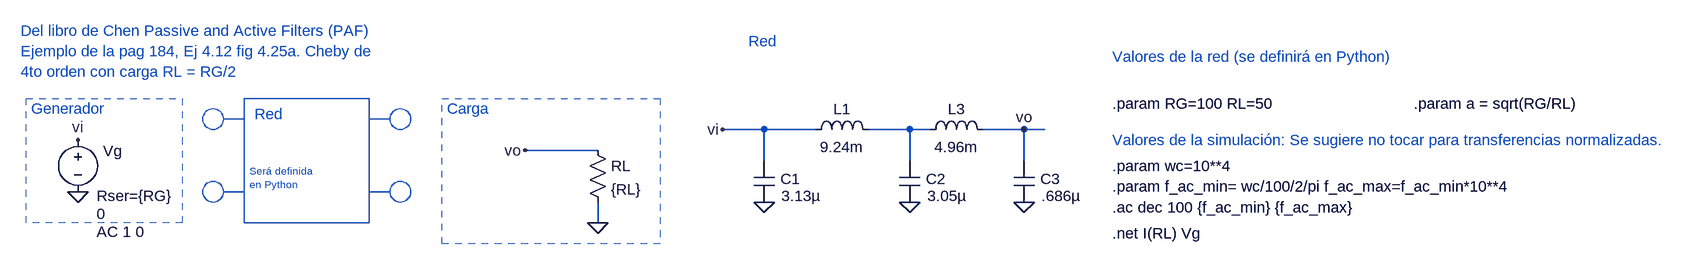
[diagram p0: schematic spar chen PAF butter 5 Ej 4.12 fig 4.25a.asc]
spar chen PAF butter 5 Ej 4.12 fig 4.25a.asc, the LTspice schematic file:
Version 4
SHEET 1 1884 872
WIRE -112 144 -176 144
WIRE -32 144 -112 144
WIRE 112 144 48 144
WIRE 144 144 112 144
WIRE 288 144 224 144
WIRE 320 144 288 144
WIRE -368 176 -480 176
WIRE -112 192 -112 144
WIRE 112 192 112 144
WIRE 288 192 288 144
WIRE -368 288 -368 256
FLAG -1168 240 0
FLAG -112 256 0
FLAG -368 288 0
FLAG -1168 160 vi
FLAG -480 176 vo
FLAG 288 144 vo
FLAG 112 256 0
FLAG -176 144 vi
FLAG 288 256 0
SYMBOL voltage -1168 144 R0
WINDOW 3 29 130 Left 2
WINDOW 123 29 158 Left 2
WINDOW 39 29 102 Left 2
WINDOW 0 39 33 Left 2
SYMATTR Value 0
SYMATTR Value2 AC 1 0
SYMATTR SpiceLine Rser={RG}
SYMATTR InstName Vg
SYMBOL res -384 160 R0
SYMATTR InstName RL
SYMATTR Value {RL}
SYMBOL cap -128 192 R0
WINDOW 0 41 28 Left 2
WINDOW 3 43 54 Left 2
SYMATTR InstName C1
SYMATTR Value 3.13µ
SYMBOL cap 96 192 R0
WINDOW 0 41 28 Left 2
WINDOW 3 43 54 Left 2
SYMATTR InstName C2
SYMATTR Value 3.05µ
SYMBOL ind -48 160 R270
WINDOW 0 32 56 VTop 2
WINDOW 3 5 56 VBottom 2
SYMATTR InstName L1
SYMATTR Value 9.24m
SYMBOL ind 128 160 R270
WINDOW 0 32 56 VTop 2
WINDOW 3 5 56 VBottom 2
SYMATTR InstName L3
SYMATTR Value 4.96m
SYMBOL cap 272 192 R0
WINDOW 0 41 28 Left 2
WINDOW 3 43 54 Left 2
SYMATTR InstName C3
SYMATTR Value .686µ
TEXT 424 304 Left 2 !.net I(RL) Vg
TEXT -896 120 Left 2 ;Red
TEXT -1240 112 Left 2 ;Generador
TEXT -600 112 Left 2 ;Carga
TEXT -904 208 Left 1 ;Será definida \nen Python
TEXT 424 32 Left 2 ;Valores de la red (se definirá en Python)
TEXT 424 104 Left 2 !.param RG=100 RL=50
TEXT -1256 -8 Left 2 ;Del libro de Chen Passive and Active Filters (PAF)\nEjemplo de la pag 184, Ej 4.12 fig 4.25a. Cheby de \n4to orden con carga RL = RG/2
TEXT 424 160 Left 2 ;Valores de la simulación: Se sugiere no tocar para transferencias normalizadas.
TEXT -136 8 Left 2 ;Red
TEXT 888 104 Left 2 !.param a = sqrt(RG/RL)
TEXT 424 264 Left 2 !.ac dec 100 {f_ac_min} {f_ac_max}
TEXT 424 200 Left 2 !.param wc=10**4
TEXT 424 232 Left 2 !.param f_ac_min= wc/100/2/pi f_ac_max=f_ac_min*10**4
LINE Normal -912 128 -944 128
LINE Normal -912 240 -944 240
LINE Normal -720 240 -688 240
LINE Normal -720 128 -688 128
RECTANGLE Normal -720 288 -912 96
RECTANGLE Normal -1008 288 -1248 96 2
RECTANGLE Normal -272 320 -608 96 2
CIRCLE Normal -944 144 -976 112
CIRCLE Normal -944 256 -976 224
CIRCLE Normal -688 224 -656 256
CIRCLE Normal -688 112 -656 144

The netlist it stands for:
* spar chen PAF butter 5 Ej 4.12 fig 4.25a.asc
Vg vi 0 0 AC 1 0 Rser={RG}
RL vo 0 {RL}
C1 vi 0 3.13µ
C2 N001 0 3.05µ
L1 vi N001 9.24m
L3 N001 vo 4.96m
C3 vo 0 .686µ
.net I(RL) Vg
* Red
* Generador
* Carga
* Será definida
* en Python
* Valores de la red (se definirá en Python)
.param RG=100 RL=50
* Del libro de Chen Passive and Active Filters (PAF)
* Ejemplo de la pag 184, Ej 4.12 fig 4.25a. Cheby de
* 4to orden con carga RL = RG/2
* Valores de la simulación: Se sugiere no tocar para transferencias normalizadas.
* Red
.param a = sqrt(RG/RL)
.ac dec 100 {f_ac_min} {f_ac_max}
.param wc=10**4
.param f_ac_min= wc/100/2/pi f_ac_max=f_ac_min*10**4
.backanno
.end

* Results of the author's LTspice run, read from the files saved beside the schematic
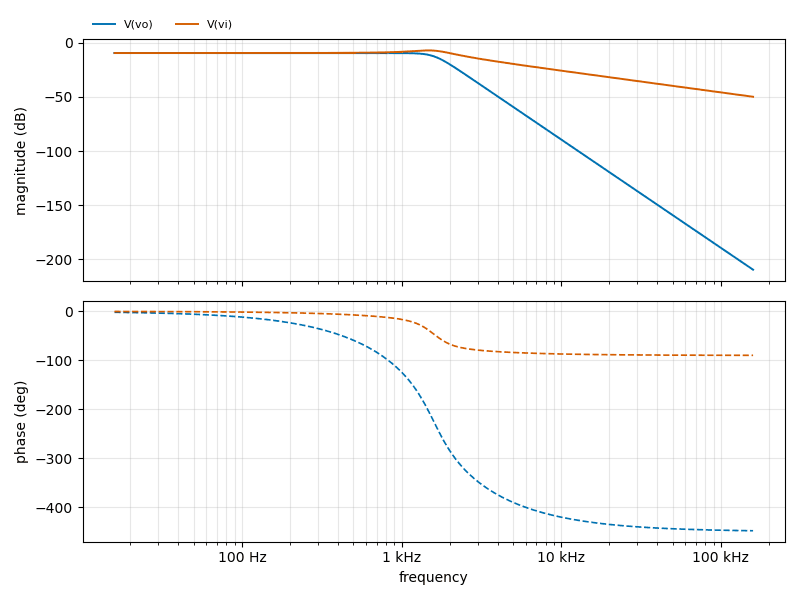
[diagram p1: AC Analysis of spar chen PAF butter 5 Ej 4.12 fig 4.25a.asc, plotted from the saved traces]
* AC Analysis, 1 run:
*   V(vo): -9.54 dB at 15.92 Hz, -209.55 dB at 159.2 kHz, peak -9.54 dB at 551.8 Hz, 3 dB below the peak at 1.592 kHz
*   V(vi): -9.54 dB at 15.92 Hz, -49.91 dB at 159.2 kHz, peak -7.11 dB at 1.485 kHz, 3 dB below the peak at 2.08 kHz